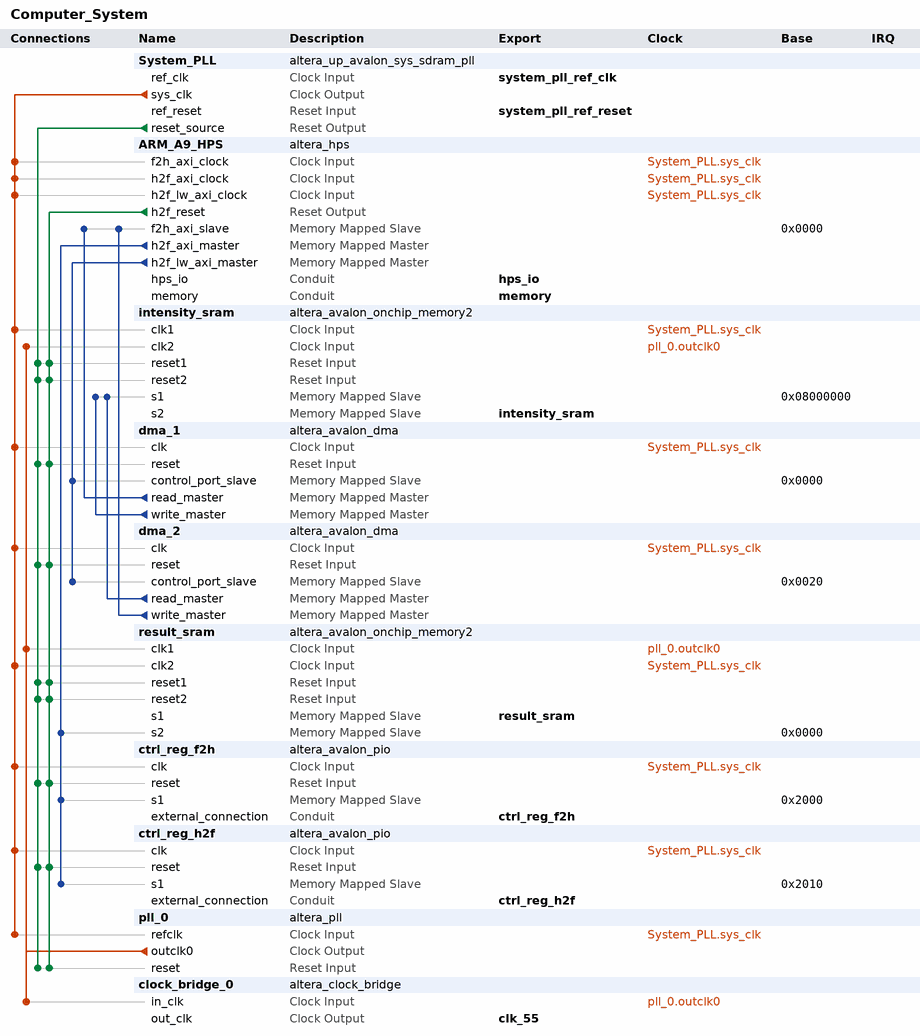
[diagram p0: system contents]
# Platform Designer (Qsys) system Computer_System, Cyclone V 5CSEMA5F31C6
# Parameters at their usual value, and those the tool derives, are not listed.
package require -exact qsys 18.1
create_system Computer_System
set_project_property DEVICE_FAMILY {Cyclone V}
set_project_property DEVICE 5CSEMA5F31C6

add_instance System_PLL altera_up_avalon_sys_sdram_pll 18.0
set_instance_parameter_value System_PLL CV_boards DE1-SoC
set_instance_parameter_value System_PLL gui_outclk 100.0
set_instance_parameter_value System_PLL gui_refclk 50.0

add_instance ARM_A9_HPS altera_hps 18.1
set_instance_parameter_value ARM_A9_HPS EMAC1_Mode RGMII
set_instance_parameter_value ARM_A9_HPS EMAC1_PinMuxing {HPS I/O Set 0}
set_instance_parameter_value ARM_A9_HPS F2SCLK_COLDRST_Enable false
set_instance_parameter_value ARM_A9_HPS F2SCLK_DBGRST_Enable false
set_instance_parameter_value ARM_A9_HPS F2SCLK_WARMRST_Enable false
set_instance_parameter_value ARM_A9_HPS F2SINTERRUPT_Enable true
set_instance_parameter_value ARM_A9_HPS F2S_Width 2
set_instance_parameter_value ARM_A9_HPS FPGA_PERIPHERAL_OUTPUT_CLOCK_FREQ_EMAC0_GTX_CLK 125
set_instance_parameter_value ARM_A9_HPS FPGA_PERIPHERAL_OUTPUT_CLOCK_FREQ_EMAC0_MD_CLK 100.0
set_instance_parameter_value ARM_A9_HPS FPGA_PERIPHERAL_OUTPUT_CLOCK_FREQ_EMAC1_GTX_CLK 125
set_instance_parameter_value ARM_A9_HPS FPGA_PERIPHERAL_OUTPUT_CLOCK_FREQ_EMAC1_MD_CLK 100.0
set_instance_parameter_value ARM_A9_HPS HPS_PROTOCOL DDR3
set_instance_parameter_value ARM_A9_HPS I2C0_Mode I2C
set_instance_parameter_value ARM_A9_HPS I2C0_PinMuxing {HPS I/O Set 0}
set_instance_parameter_value ARM_A9_HPS I2C1_Mode I2C
set_instance_parameter_value ARM_A9_HPS I2C1_PinMuxing {HPS I/O Set 0}
set_instance_parameter_value ARM_A9_HPS LWH2F_Enable true
set_instance_parameter_value ARM_A9_HPS MEM_BANKADDR_WIDTH 3
set_instance_parameter_value ARM_A9_HPS MEM_CLK_FREQ 400.0
set_instance_parameter_value ARM_A9_HPS MEM_COL_ADDR_WIDTH 10
set_instance_parameter_value ARM_A9_HPS MEM_DQ_WIDTH 32
set_instance_parameter_value ARM_A9_HPS MEM_DRV_STR RZQ/7
set_instance_parameter_value ARM_A9_HPS MEM_ROW_ADDR_WIDTH 15
set_instance_parameter_value ARM_A9_HPS MEM_RTT_NOM RZQ/4
set_instance_parameter_value ARM_A9_HPS MEM_RTT_WR RZQ/4
set_instance_parameter_value ARM_A9_HPS MEM_TCL 11
set_instance_parameter_value ARM_A9_HPS MEM_TFAW_NS 30.0
set_instance_parameter_value ARM_A9_HPS MEM_TRAS_NS 35.0
set_instance_parameter_value ARM_A9_HPS MEM_TRCD_NS 13.75
set_instance_parameter_value ARM_A9_HPS MEM_TRFC_NS 260.0
set_instance_parameter_value ARM_A9_HPS MEM_TRP_NS 13.75
set_instance_parameter_value ARM_A9_HPS MEM_VENDOR JEDEC
set_instance_parameter_value ARM_A9_HPS MEM_WTCL 8
set_instance_parameter_value ARM_A9_HPS QSPI_Mode {1 SS}
set_instance_parameter_value ARM_A9_HPS QSPI_PinMuxing {HPS I/O Set 0}
set_instance_parameter_value ARM_A9_HPS REF_CLK_FREQ 25.0
set_instance_parameter_value ARM_A9_HPS S2FCLK_USER2CLK 5
set_instance_parameter_value ARM_A9_HPS S2F_Width 3
set_instance_parameter_value ARM_A9_HPS SDIO_Mode {4-bit Data}
set_instance_parameter_value ARM_A9_HPS SDIO_PinMuxing {HPS I/O Set 0}
set_instance_parameter_value ARM_A9_HPS SPIM1_Mode {Single Slave Select}
set_instance_parameter_value ARM_A9_HPS SPIM1_PinMuxing {HPS I/O Set 0}
set_instance_parameter_value ARM_A9_HPS STM_Enable false
set_instance_parameter_value ARM_A9_HPS TIMING_BOARD_AC_SKEW 0.03
set_instance_parameter_value ARM_A9_HPS TIMING_BOARD_AC_TO_CK_SKEW 0.0
set_instance_parameter_value ARM_A9_HPS TIMING_BOARD_DQ_TO_DQS_SKEW 0.0
set_instance_parameter_value ARM_A9_HPS TIMING_BOARD_MAX_CK_DELAY 0.03
set_instance_parameter_value ARM_A9_HPS TIMING_BOARD_MAX_DQS_DELAY 0.02
set_instance_parameter_value ARM_A9_HPS TIMING_BOARD_SKEW_BETWEEN_DQS 0.08
set_instance_parameter_value ARM_A9_HPS TIMING_BOARD_SKEW_CKDQS_DIMM_MAX 0.16
set_instance_parameter_value ARM_A9_HPS TIMING_BOARD_SKEW_CKDQS_DIMM_MIN 0.09
set_instance_parameter_value ARM_A9_HPS TIMING_BOARD_SKEW_WITHIN_DQS 0.01
set_instance_parameter_value ARM_A9_HPS TIMING_TDH 65
set_instance_parameter_value ARM_A9_HPS TIMING_TDQSCK 255
set_instance_parameter_value ARM_A9_HPS TIMING_TDQSQ 125
set_instance_parameter_value ARM_A9_HPS TIMING_TDS 30
set_instance_parameter_value ARM_A9_HPS TIMING_TIH 140
set_instance_parameter_value ARM_A9_HPS TIMING_TIS 180
set_instance_parameter_value ARM_A9_HPS TIMING_TQSH 0.4
set_instance_parameter_value ARM_A9_HPS UART0_Mode {No Flow Control}
set_instance_parameter_value ARM_A9_HPS UART0_PinMuxing {HPS I/O Set 0}
set_instance_parameter_value ARM_A9_HPS USB1_Mode SDR
set_instance_parameter_value ARM_A9_HPS USB1_PinMuxing {HPS I/O Set 0}
set_instance_parameter_value ARM_A9_HPS desired_cfg_clk_mhz 100.0
set_instance_parameter_value ARM_A9_HPS desired_qspi_clk_mhz 400.0

add_instance intensity_sram altera_avalon_onchip_memory2 18.1
set_instance_parameter_value intensity_sram dataWidth 8
set_instance_parameter_value intensity_sram dualPort true
set_instance_parameter_value intensity_sram initMemContent true
set_instance_parameter_value intensity_sram initializationFileName onchip_mem.hex
set_instance_parameter_value intensity_sram memorySize 65536

add_instance dma_1 altera_avalon_dma 18.1
set_instance_parameter_value dma_1 allowByteTransactions false
set_instance_parameter_value dma_1 allowDoubleWordTransactions false
set_instance_parameter_value dma_1 allowHalfWordTransactions false
set_instance_parameter_value dma_1 allowQuadWordTransactions false
set_instance_parameter_value dma_1 burstEnable false
set_instance_parameter_value dma_1 fifoDepth 32
set_instance_parameter_value dma_1 maxBurstSize 128
set_instance_parameter_value dma_1 minimumDmaTransactionRegisterWidth 16

add_instance dma_2 altera_avalon_dma 18.1
set_instance_parameter_value dma_2 allowByteTransactions false
set_instance_parameter_value dma_2 allowDoubleWordTransactions false
set_instance_parameter_value dma_2 allowHalfWordTransactions false
set_instance_parameter_value dma_2 allowQuadWordTransactions false
set_instance_parameter_value dma_2 burstEnable false
set_instance_parameter_value dma_2 fifoDepth 32
set_instance_parameter_value dma_2 maxBurstSize 128
set_instance_parameter_value dma_2 minimumDmaTransactionRegisterWidth 16

add_instance result_sram altera_avalon_onchip_memory2 18.1
set_instance_parameter_value result_sram dataWidth 32
set_instance_parameter_value result_sram dualPort true
set_instance_parameter_value result_sram initMemContent true
set_instance_parameter_value result_sram initializationFileName onchip_mem.hex
set_instance_parameter_value result_sram memorySize 8192

add_instance ctrl_reg_f2h altera_avalon_pio 18.1
set_instance_parameter_value ctrl_reg_f2h direction Input
set_instance_parameter_value ctrl_reg_f2h width 8

add_instance ctrl_reg_h2f altera_avalon_pio 18.1
set_instance_parameter_value ctrl_reg_h2f direction Output
set_instance_parameter_value ctrl_reg_h2f width 8

add_instance pll_0 altera_pll 18.1
set_instance_parameter_value pll_0 gui_device_speed_grade 1
set_instance_parameter_value pll_0 gui_number_of_clocks 1
set_instance_parameter_value pll_0 gui_operation_mode direct
set_instance_parameter_value pll_0 gui_output_clock_frequency0 50.0
set_instance_parameter_value pll_0 gui_pll_mode {Integer-N PLL}
set_instance_parameter_value pll_0 gui_reference_clock_frequency 100.0
set_instance_parameter_value pll_0 gui_use_locked true

add_instance clock_bridge_0 altera_clock_bridge 18.1
set_instance_parameter_value clock_bridge_0 DERIVED_CLOCK_RATE 50000000
set_instance_parameter_value clock_bridge_0 EXPLICIT_CLOCK_RATE 25000000

# connections
add_connection pll_0.outclk0 clock_bridge_0.in_clk clock
add_connection pll_0.outclk0 intensity_sram.clk2 clock
add_connection pll_0.outclk0 result_sram.clk1 clock
add_connection System_PLL.sys_clk ARM_A9_HPS.f2h_axi_clock clock
add_connection System_PLL.sys_clk ARM_A9_HPS.h2f_axi_clock clock
add_connection System_PLL.sys_clk ARM_A9_HPS.h2f_lw_axi_clock clock
add_connection System_PLL.sys_clk ctrl_reg_f2h.clk clock
add_connection System_PLL.sys_clk ctrl_reg_h2f.clk clock
add_connection System_PLL.sys_clk dma_1.clk clock
add_connection System_PLL.sys_clk dma_2.clk clock
add_connection System_PLL.sys_clk intensity_sram.clk1 clock
add_connection System_PLL.sys_clk pll_0.refclk clock
add_connection System_PLL.sys_clk result_sram.clk2 clock
add_connection ARM_A9_HPS.h2f_reset ctrl_reg_f2h.reset reset
add_connection ARM_A9_HPS.h2f_reset ctrl_reg_h2f.reset reset
add_connection ARM_A9_HPS.h2f_reset dma_1.reset reset
add_connection ARM_A9_HPS.h2f_reset dma_2.reset reset
add_connection ARM_A9_HPS.h2f_reset intensity_sram.reset1 reset
add_connection ARM_A9_HPS.h2f_reset intensity_sram.reset2 reset
add_connection ARM_A9_HPS.h2f_reset pll_0.reset reset
add_connection ARM_A9_HPS.h2f_reset result_sram.reset1 reset
add_connection ARM_A9_HPS.h2f_reset result_sram.reset2 reset
add_connection System_PLL.reset_source ctrl_reg_f2h.reset reset
add_connection System_PLL.reset_source ctrl_reg_h2f.reset reset
add_connection System_PLL.reset_source dma_1.reset reset
add_connection System_PLL.reset_source dma_2.reset reset
add_connection System_PLL.reset_source intensity_sram.reset1 reset
add_connection System_PLL.reset_source intensity_sram.reset2 reset
add_connection System_PLL.reset_source pll_0.reset reset
add_connection System_PLL.reset_source result_sram.reset1 reset
add_connection System_PLL.reset_source result_sram.reset2 reset
add_connection ARM_A9_HPS.h2f_axi_master ctrl_reg_f2h.s1 avalon
set_connection_parameter_value ARM_A9_HPS.h2f_axi_master/ctrl_reg_f2h.s1 baseAddress 0x2000
add_connection ARM_A9_HPS.h2f_axi_master ctrl_reg_h2f.s1 avalon
set_connection_parameter_value ARM_A9_HPS.h2f_axi_master/ctrl_reg_h2f.s1 baseAddress 0x2010
add_connection ARM_A9_HPS.h2f_axi_master result_sram.s2 avalon
set_connection_parameter_value ARM_A9_HPS.h2f_axi_master/result_sram.s2 baseAddress 0x0000
add_connection ARM_A9_HPS.h2f_lw_axi_master dma_1.control_port_slave avalon
set_connection_parameter_value ARM_A9_HPS.h2f_lw_axi_master/dma_1.control_port_slave baseAddress 0x0000
add_connection ARM_A9_HPS.h2f_lw_axi_master dma_2.control_port_slave avalon
set_connection_parameter_value ARM_A9_HPS.h2f_lw_axi_master/dma_2.control_port_slave baseAddress 0x0020
add_connection dma_1.read_master ARM_A9_HPS.f2h_axi_slave avalon
set_connection_parameter_value dma_1.read_master/ARM_A9_HPS.f2h_axi_slave baseAddress 0x0000
add_connection dma_1.write_master intensity_sram.s1 avalon
set_connection_parameter_value dma_1.write_master/intensity_sram.s1 baseAddress 0x08000000
add_connection dma_2.read_master intensity_sram.s1 avalon
set_connection_parameter_value dma_2.read_master/intensity_sram.s1 baseAddress 0x08000000
add_connection dma_2.write_master ARM_A9_HPS.f2h_axi_slave avalon
set_connection_parameter_value dma_2.write_master/ARM_A9_HPS.f2h_axi_slave baseAddress 0x0000

# exported interfaces
add_interface clk_55 clock source
set_interface_property clk_55 EXPORT_OF clock_bridge_0.out_clk
add_interface ctrl_reg_f2h conduit end
set_interface_property ctrl_reg_f2h EXPORT_OF ctrl_reg_f2h.external_connection
add_interface ctrl_reg_h2f conduit end
set_interface_property ctrl_reg_h2f EXPORT_OF ctrl_reg_h2f.external_connection
add_interface hps_io conduit end
set_interface_property hps_io EXPORT_OF ARM_A9_HPS.hps_io
add_interface intensity_sram avalon slave
set_interface_property intensity_sram EXPORT_OF intensity_sram.s2
add_interface memory conduit end
set_interface_property memory EXPORT_OF ARM_A9_HPS.memory
add_interface result_sram avalon slave
set_interface_property result_sram EXPORT_OF result_sram.s1
add_interface system_pll_ref_clk clock sink
set_interface_property system_pll_ref_clk EXPORT_OF System_PLL.ref_clk
add_interface system_pll_ref_reset reset sink
set_interface_property system_pll_ref_reset EXPORT_OF System_PLL.ref_reset

set_interconnect_requirement {$system} qsys_mm.clockCrossingAdapter HANDSHAKE
set_interconnect_requirement {$system} qsys_mm.enableEccProtection FALSE
set_interconnect_requirement {$system} qsys_mm.insertDefaultSlave FALSE
set_interconnect_requirement {$system} qsys_mm.maxAdditionalLatency 1

save_system Computer_System.qsys
